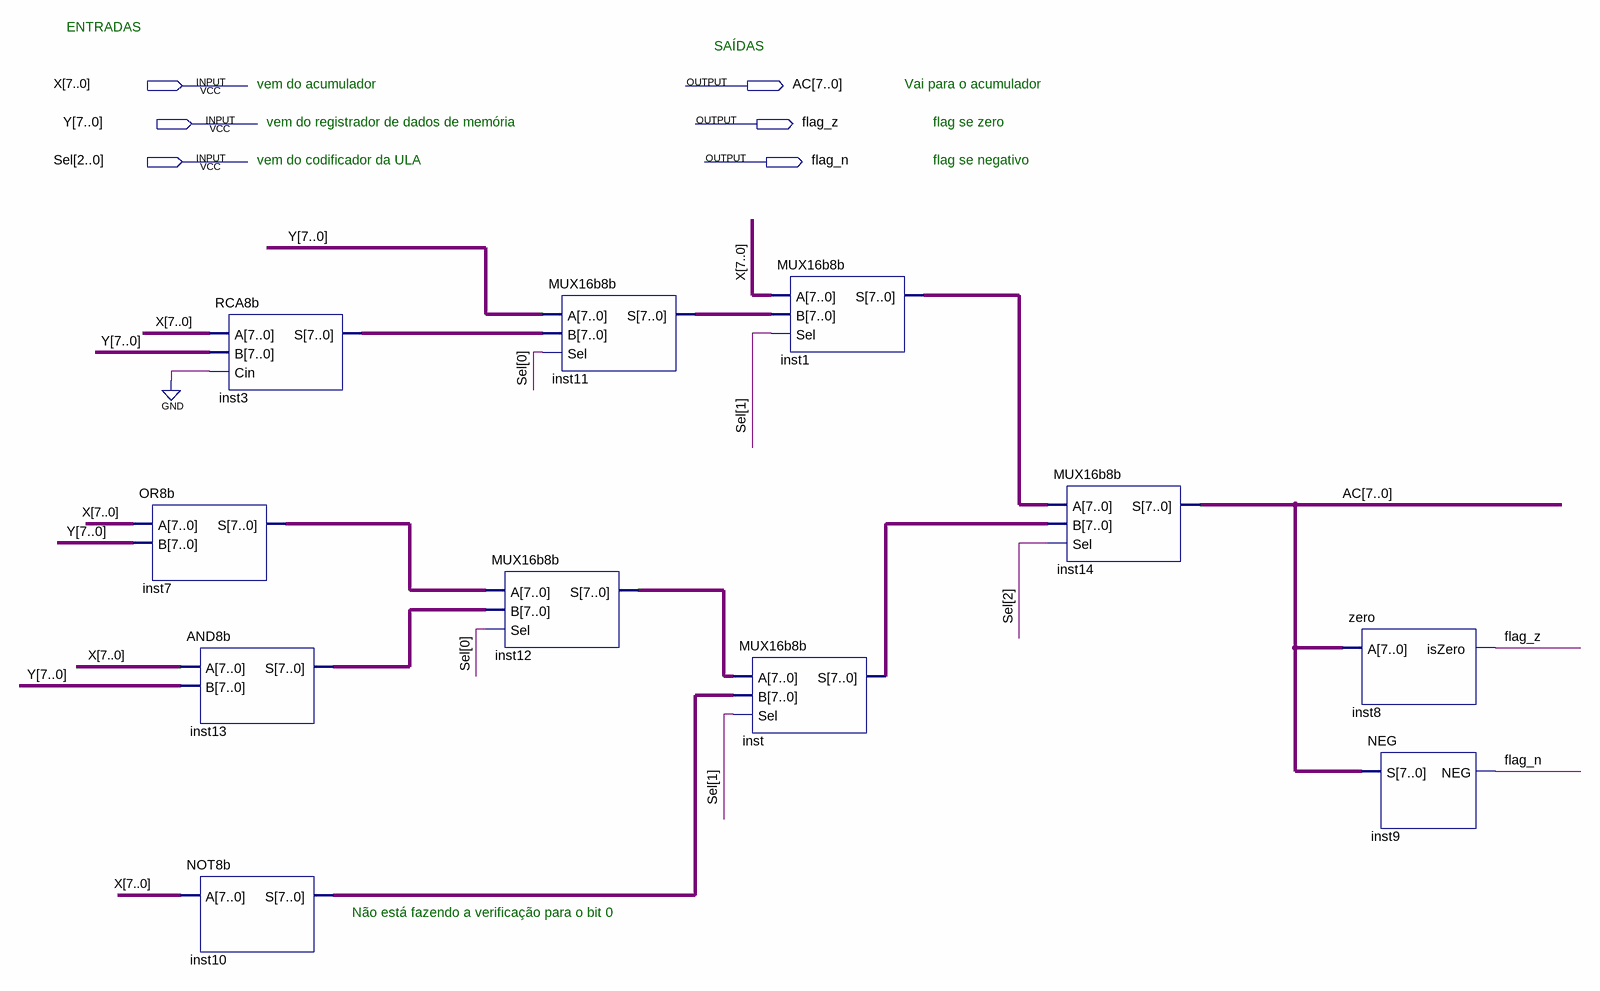
[diagram p0: schematic sheet]
// Quartus schematic ULA.bdf as structural Verilog: 11 symbols, 6 pins
module ULA (
  input  [7:0] X,
  input  [7:0] Y,
  input  [2:0] Sel,
  output [7:0] AC,
  output flag_z,
  output flag_n
);

  wire [7:0] inst1_s, inst3_s, inst7_s, inst10_s, inst11_s, inst12_s, inst13_s, inst_s;

  OR8b inst7 (.A(X), .B(Y), .S(inst7_s));
  RCA8b inst3 (.A(X), .B(Y), .Cin(1'b0), .S(inst3_s));
  AND8b inst13 (.A(X), .B(Y), .S(inst13_s));
  NOT8b inst10 (.A(X), .S(inst10_s));
  MUX16b8b inst12 (.A(inst7_s), .B(inst13_s), .Sel(Sel[0]), .S(inst12_s));
  MUX16b8b inst11 (.A(Y), .B(inst3_s), .Sel(Sel[0]), .S(inst11_s));
  MUX16b8b inst (.A(inst12_s), .B(inst10_s), .Sel(Sel[1]), .S(inst_s));
  MUX16b8b inst1 (.A(X), .B(inst11_s), .Sel(Sel[1]), .S(inst1_s));
  MUX16b8b inst14 (.A(inst1_s), .B(inst_s), .Sel(Sel[2]), .S(AC));
  zero inst8 (.A(AC), .isZero(flag_z));
  NEG inst9 (.S(AC), .NEG(flag_n));

  // Notes on the sheet:
  //   ENTRADAS
  //   SAÍDAS
  //   vem do acumulador
  //   Vai para o acumulador
  //   vem do registrador de dados de memória
  //   flag se zero
  //   vem do codificador da ULA
  //   flag se negativo
  //   Não está fazendo a verificação para o bit 0
endmodule
